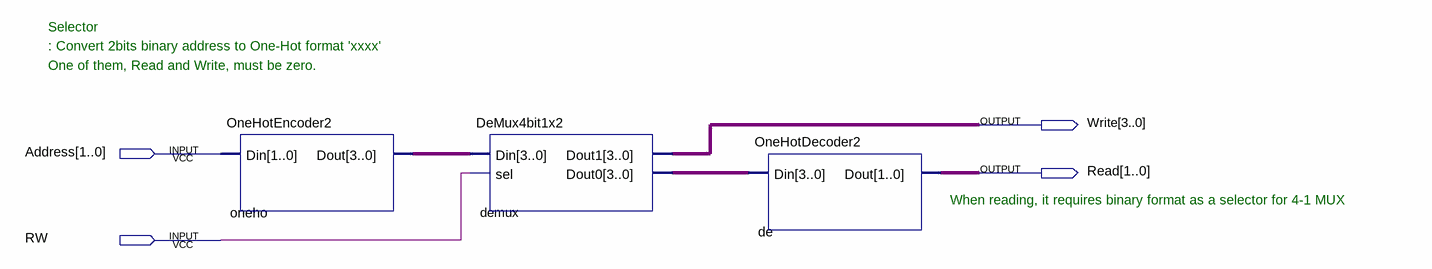
[diagram p0: schematic sheet]
// Quartus schematic Selector.bdf as structural Verilog: 3 symbols, 4 pins
module Selector (
  input  [1:0] Address,
  input  RW,
  output [3:0] Write,
  output [1:0] Read
);

  wire [3:0] demux_dout0, oneho_dout;

  OneHotEncoder2 oneho (.Din(Address), .Dout(oneho_dout));
  DeMux4bit1x2 demux (.Din(oneho_dout), .sel(RW), .Dout1(Write), .Dout0(demux_dout0));
  OneHotDecoder2 de (.Din(demux_dout0), .Dout(Read));

  // Notes on the sheet:
  //   Selector
  //   : Convert 2bits binary address to One-Hot format 'xxxx'
  //   One of them, Read and Write, must be zero. 
  //   When reading, it requires binary format as a selector for 4-1 MUX
endmodule
